# Altium schematic sheet 08-1G Phy2.SchDoc
size B; SheetNumber: 8; SheetTotal: 25; SPICEModelCacheUFVORJTV: <root> / <DocumentId>UFVORJTV</DocumentId> / <CacheFrame Number="0"> / <Model Name="emk105bj105_v-f" Kind="CKT"> / <Text>* EMK105BJ105_V-F     SPICE MODEL  ( General Type ) / *-------------------------------------------------------------------------------------------------------- / * Model Generated by TAIYO YUDEN Corporation (http://www.ty-top.com) / * Version 1.0 / * TAIYO YUDEN Control No. 170508_130520 / * Copyright(c) 2012 TAIYO YUDEN CO.,LTD. All Rights Reserved. / *-------------------------------------------------------------------------------------------------------- / * / * Products Name : Multilayer Ceramic Capacitors / * / * Characteristics : / *     Capacitance : 1 uF , Rated Voltage : 16V , TCC : X5R / *     Case Size : 1.0 x 0.5 / 0.039 x 0.02 [mm/inch] , Thickness : 0.5 / 0.02 [mm/inch] / *     (Conditions: Temperature = 25 degC , DC Bias Current/Voltage = 0A / 0V) / * / * Frequency Range : 40Hz - 3GHz / * / * External Node Assignments : / * / *  1  o---| |---o  2 / * / *-------------------------------------------------------------------------------------------------------- / .SubCkt EMK105BJ105_V-F 1 2 / **************************** / C0 1 110 0.68309u / Cm 1 101 0.26053u / C1 101 102 0.94076u / Rc1 101 102 1.9029k / C2 102 103 0.66707u / Rc2 102 103 120.36 / C3 103 110 0.57203u / Rc3 103 110 2.1097 / C2m 1 301 0.1871u / C21 301 302 3.2494u / Rc21 301 302 1.1117k / C22 302 303 2.1014u / Rc22 302 303 1.484k / C23 303 304 2.1172u / Rc23 303 304 1.3876k / C24 304 305 0.75729u / Rc24 304 305 332.59 / C25 305 306 0.94401u / Rc25 305 306 249.09 / C26 306 307 0.34674u / Rc26 306 307 28.352 / C27 307 308 0.37158u / Rc27 307 308 19.989 / C28 308 309 0.17933u / Rc28 308 309 31.748 / C29 309 110 0.016445u / Rc29 309 110 1.0592 / Rp0 1 110 100Meg / L0 110 120 0.2216n / Lm 120 130 0.1509n / L1 120 121 0.12659n / RL1 121 130 0.85161 / L2 120 122 0.15996n / RL2 122 130 0.42469 / L3 120 123 7.9543n / RL3 123 130 0.54643m / CR 120 124 0.24334u / LR 124 125 0.090738n / RR 125 130 68.076m / CL 130 140 2.7354p / LL 130 140 0.10762n / RL 130 140 50.614 / Rs 140 2 7.5416m / **************************** / .ends EMK105BJ105_V-F</Text> / </Model> / </CacheFrame> / </root>
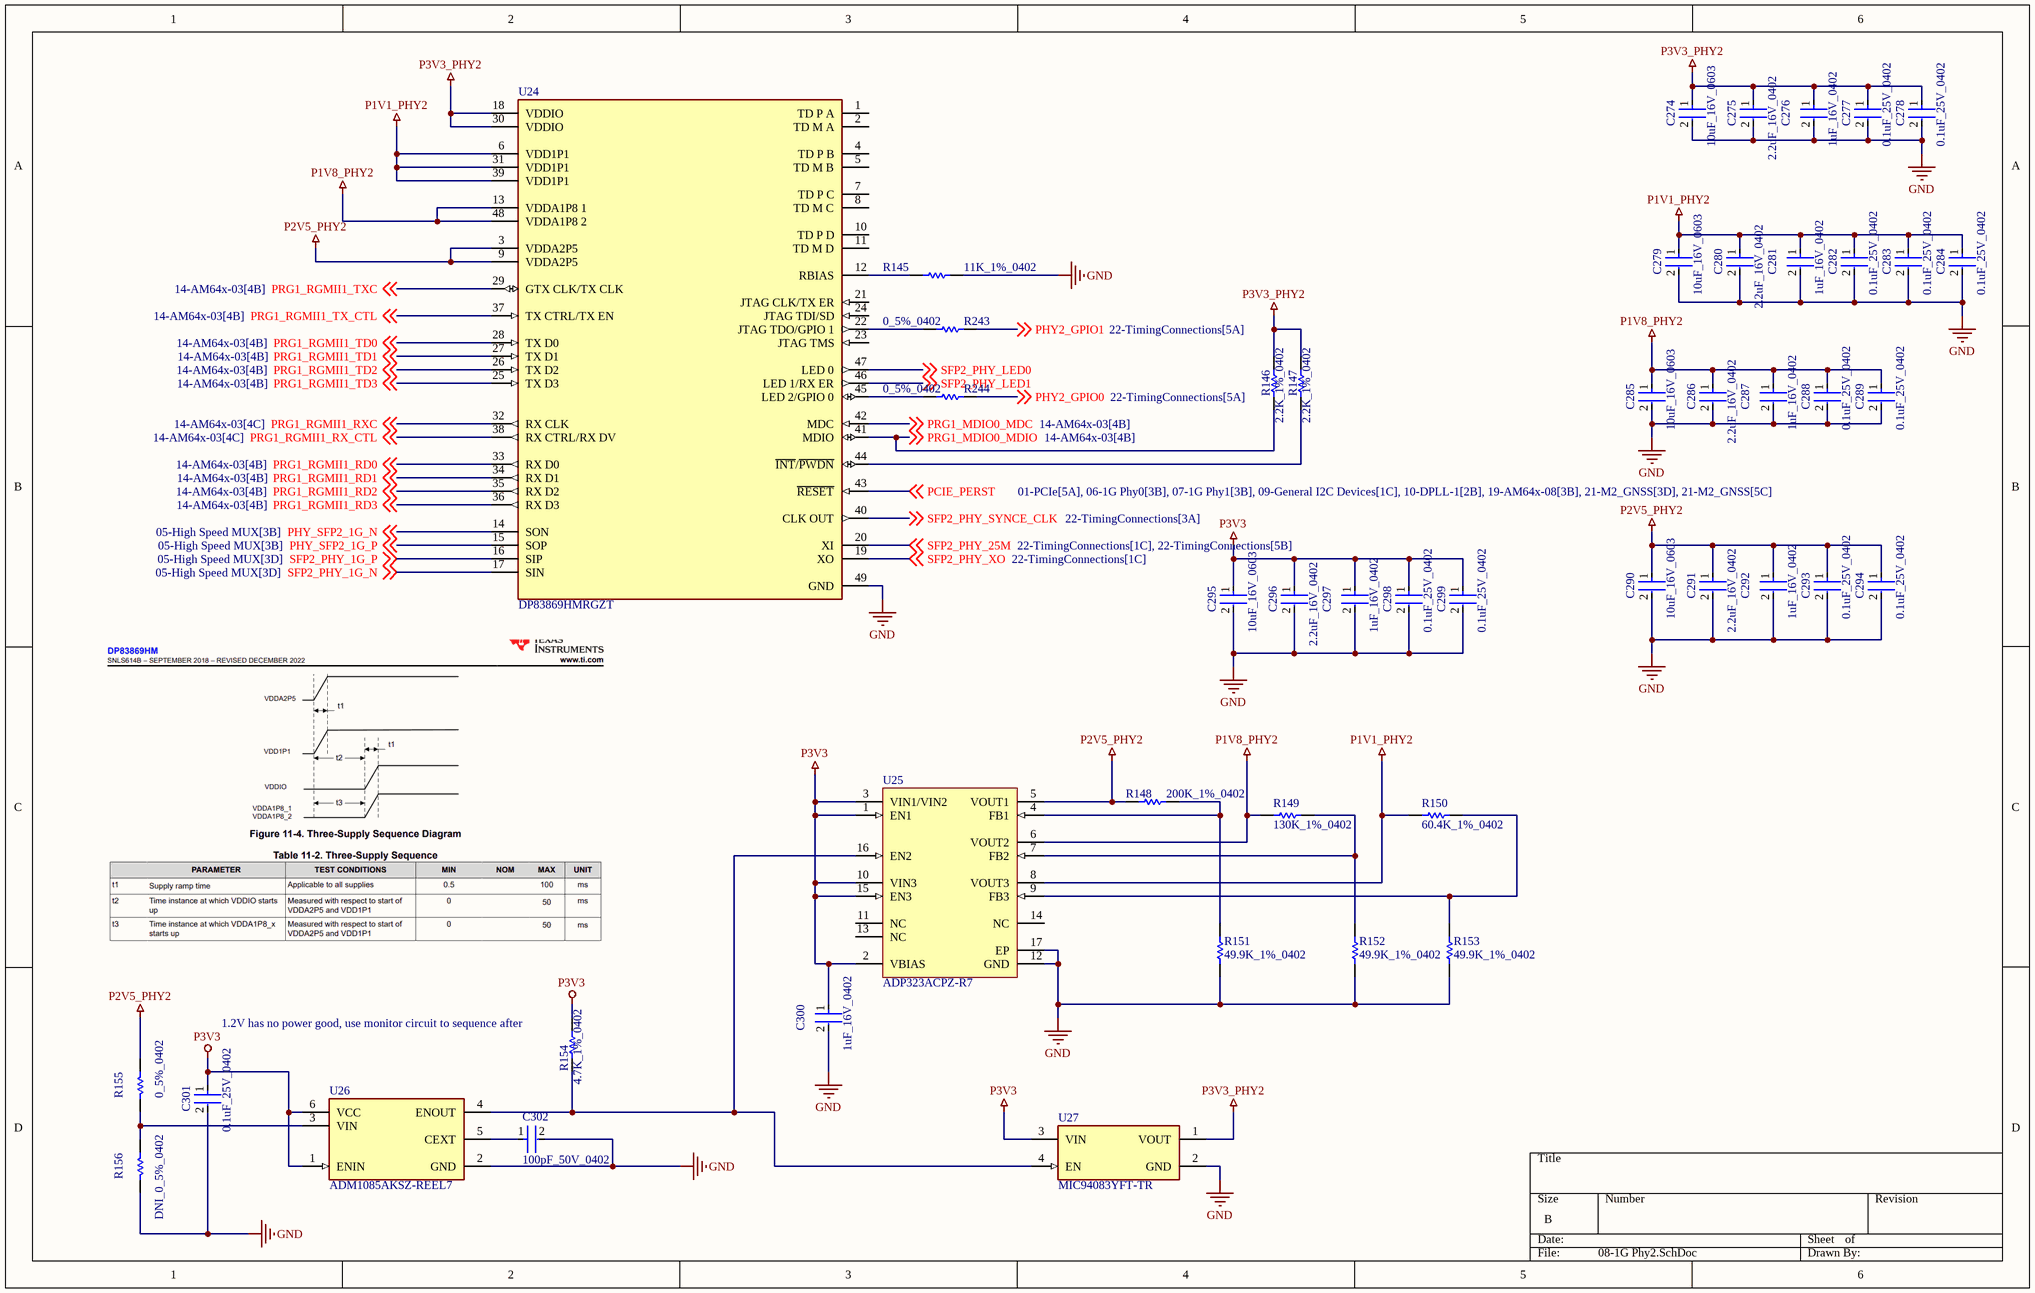
[diagram p0: 08-1G Phy2.SchDoc]

## Parts
C274  10uF_16V_0603  [FP-0603-L_1_6_0_2-W_0_8_0-MFG]
C275  2.2uF_16V_0402  [FP-C1005-050-0_05-IPC_A]
C276  1uF_16V_0402  [FP-0402-L_1_0_0_05-W_0_5-IPC_A]
C277  0.1uF_25V_0402  [FP-0402-L_1_0_1-W_0_5_0_1-IPC_C]
C278  0.1uF_25V_0402  [FP-0402-L_1_0_1-W_0_5_0_1-IPC_C]
C279  10uF_16V_0603  [FP-0603-L_1_6_0_2-W_0_8_0-MFG]
C280  2.2uF_16V_0402  [FP-C1005-050-0_05-IPC_A]
C281  1uF_16V_0402  [FP-0402-L_1_0_0_05-W_0_5-IPC_A]
C282  0.1uF_25V_0402  [FP-0402-L_1_0_1-W_0_5_0_1-IPC_C]
C283  0.1uF_25V_0402  [FP-0402-L_1_0_1-W_0_5_0_1-IPC_C]
C284  0.1uF_25V_0402  [FP-0402-L_1_0_1-W_0_5_0_1-IPC_C]
C285  10uF_16V_0603  [FP-0603-L_1_6_0_2-W_0_8_0-MFG]
C286  2.2uF_16V_0402  [FP-C1005-050-0_05-IPC_A]
C287  1uF_16V_0402  [FP-0402-L_1_0_0_05-W_0_5-IPC_A]
C288  0.1uF_25V_0402  [FP-0402-L_1_0_1-W_0_5_0_1-IPC_C]
C289  0.1uF_25V_0402  [FP-0402-L_1_0_1-W_0_5_0_1-IPC_C]
C290  10uF_16V_0603  [FP-0603-L_1_6_0_2-W_0_8_0-MFG]
C291  2.2uF_16V_0402  [FP-C1005-050-0_05-IPC_A]
C292  1uF_16V_0402  [FP-0402-L_1_0_0_05-W_0_5-IPC_A]
C293  0.1uF_25V_0402  [FP-0402-L_1_0_1-W_0_5_0_1-IPC_C]
C294  0.1uF_25V_0402  [FP-0402-L_1_0_1-W_0_5_0_1-IPC_C]
C295  10uF_16V_0603  [FP-0603-L_1_6_0_2-W_0_8_0-MFG]
C296  2.2uF_16V_0402  [FP-C1005-050-0_05-IPC_A]
C297  1uF_16V_0402  [FP-0402-L_1_0_0_05-W_0_5-IPC_A]
C298  0.1uF_25V_0402  [FP-0402-L_1_0_1-W_0_5_0_1-IPC_C]
C299  0.1uF_25V_0402  [FP-0402-L_1_0_1-W_0_5_0_1-IPC_C]
C300  1uF_16V_0402  [FP-0402-L_1_0_0_05-W_0_5-IPC_A]
C301  0.1uF_25V_0402  [FP-0402-L_1_0_1-W_0_5_0_1-IPC_C]
C302  100pF_50V_0402  [FP-C0402-BB-MFG]
R145  11K_1%_0402  [RESC1005X40X25LL05T10]
R146  2.2K_1%_0402  [RESC1005X40X25ML10T10]
R147  2.2K_1%_0402  [RESC1005X40X25ML10T10]
R148  200K_1%_0402  [RESC1005X40X25LL10T10]
R149  130K_1%_0402  [RESC1005X40X25NL10T10]
R150  60.4K_1%_0402  [RESC1005X40X25LL05T10]
R151  49.9K_1%_0402  [RESC1005X40X25LL10T10]
R152  49.9K_1%_0402  [RESC1005X40X25LL10T10]
R153  49.9K_1%_0402  [RESC1005X40X25LL10T10]
R154  4.7K_1%_0402  [RESC1005X40X25NL10T10]
R155  0_5%_0402  [RESC1005X40X25LL10T10]
R156  DNI_0_5%_0402  [RESC1005X40X25LL10T10]  (no BOM)
R243  0_5%_0402  [RESC1005X40X25LL10T10]
R244  0_5%_0402  [RESC1005X40X25LL10T10]
U24  DP83869HMRGZT  [FP-RGZ0048B-IPC_A]
U25  ADP323ACPZ-R7  [ADI-CP-16-27_N]
U26  ADM1085AKSZ-REEL7  [FP-KS-6-IPC_B]
U27  MIC94083YFT-TR  [FP-FTDFN085085-4LD-PL-1-MFG]

## Nets
GND: C274.2 C275.2 C276.2 C277.2 C278.2 C279.2 C280.2 C281.2 C282.2 C283.2 C284.2 C285.2 C286.2 C287.2 C288.2 C289.2 C290.2 C291.2 C292.2 C293.2 C294.2 C295.2 C296.2 C297.2 C298.2 C299.2 C300.2 C301.2 C302.2 R145.2 R151.1 R152.1 R153.1 R156.2 U24.49(GND) U25.12(GND) U25.17(EP) U26.2(GND) U27.2(GND)
P1V1_PHY2: C279.1 C280.1 C281.1 C282.1 C283.1 C284.1 R150.1 U24.6(VDD1P1) U24.31(VDD1P1) U24.39(VDD1P1) U25.8(VOUT3)
P1V8_PHY2: C285.1 C286.1 C287.1 C288.1 C289.1 R149.1 U24.13(VDDA1P8_1) U24.48(VDDA1P8_2) U25.6(VOUT2)
P2V5_PHY2: C290.1 C291.1 C292.1 C293.1 C294.1 R148.1 R155.1 U24.3(VDDA2P5) U24.9(VDDA2P5) U25.5(VOUT1)
P3V3: C295.1 C296.1 C297.1 C298.1 C299.1 C300.1 C301.1 R154.1 U25.1(EN1) U25.2(VBIAS) U25.3(VIN1/VIN2) U25.10(VIN3) U25.15(EN3) U26.1(ENIN) U26.6(VCC) U27.3(VIN)
P3V3_PHY2: C274.1 C275.1 C276.1 C277.1 C278.1 R146.2 R147.2 U24.18(VDDIO) U24.30(VDDIO) U27.1(VOUT)
PCIE_PERST: U24.43(~{RESET}) ; off-sheet PCIE_PERST
PHY2_GPIO0: R244.2 ; off-sheet PHY2_GPIO0
PHY2_GPIO1: R243.2 ; off-sheet PHY2_GPIO1
PHY_SFP2_1G_N: U24.14(SON) ; off-sheet PHY_SFP2_1G_N
PHY_SFP2_1G_P: U24.15(SOP) ; off-sheet PHY_SFP2_1G_P
PRG1_MDIO0_MDC: U24.42(MDC) ; off-sheet PRG1_MDIO0_MDC
PRG1_MDIO0_MDIO: R146.1 U24.41(MDIO) ; off-sheet PRG1_MDIO0_MDIO
PRG1_RGMII1_RD0: U24.33(RX_D0) ; off-sheet PRG1_RGMII1_RD0
PRG1_RGMII1_RD1: U24.34(RX_D1) ; off-sheet PRG1_RGMII1_RD1
PRG1_RGMII1_RD2: U24.35(RX_D2) ; off-sheet PRG1_RGMII1_RD2
PRG1_RGMII1_RD3: U24.36(RX_D3) ; off-sheet PRG1_RGMII1_RD3
PRG1_RGMII1_RX_CTL: U24.38(RX_CTRL/RX_DV) ; off-sheet PRG1_RGMII1_RX_CTL
PRG1_RGMII1_RXC: U24.32(RX_CLK) ; off-sheet PRG1_RGMII1_RXC
PRG1_RGMII1_TD0: U24.28(TX_D0) ; off-sheet PRG1_RGMII1_TD0
PRG1_RGMII1_TD1: U24.27(TX_D1) ; off-sheet PRG1_RGMII1_TD1
PRG1_RGMII1_TD2: U24.26(TX_D2) ; off-sheet PRG1_RGMII1_TD2
PRG1_RGMII1_TD3: U24.25(TX_D3) ; off-sheet PRG1_RGMII1_TD3
PRG1_RGMII1_TX_CTL: U24.37(TX_CTRL/TX_EN) ; off-sheet PRG1_RGMII1_TX_CTL
PRG1_RGMII1_TXC: U24.29(GTX_CLK/TX_CLK) ; off-sheet PRG1_RGMII1_TXC
SFP2_PHY_1G_N: U24.17(SIN) ; off-sheet SFP2_PHY_1G_N
SFP2_PHY_1G_P: U24.16(SIP) ; off-sheet SFP2_PHY_1G_P
SFP2_PHY_25M: U24.20(XI) ; off-sheet SFP2_PHY_25M
SFP2_PHY_LED0: U24.47(LED_0) ; off-sheet SFP2_PHY_LED0
SFP2_PHY_LED1: U24.46(LED_1/RX_ER) ; off-sheet SFP2_PHY_LED1
SFP2_PHY_SYNCE_CLK: U24.40(CLK_OUT) ; off-sheet SFP2_PHY_SYNCE_CLK
SFP2_PHY_XO: U24.19(XO) ; off-sheet SFP2_PHY_XO
NetC302_1: C302.1 U26.5(CEXT)
NetR145_1: R145.1 U24.12(RBIAS)
NetR147_1: R147.1 U24.44(~{INT}/~{PWDN})
NetR148_2: R148.2 R151.2 U25.4(FB1)
NetR149_2: R149.2 R152.2 U25.7(FB2)
NetR150_2: R150.2 R153.2 U25.9(FB3)
NetR154_2: R154.2 U25.16(EN2) U26.4(ENOUT) U27.4(EN)
NetR155_2: R155.2 R156.1 U26.3(VIN)
NetR243_1: R243.1 U24.22(JTAG_TDO/GPIO_1)
NetR244_1: R244.1 U24.45(LED_2/GPIO_0)

Not connected (* = marked no-connect by the designer): U24 1(TD_P_A) 2(TD_M_A) 4(TD_P_B) 5(TD_M_B) 7(TD_P_C) 8(TD_M_C) 10(TD_P_D) 11(TD_M_D) 21(JTAG_CLK/TX_ER) 23(JTAG_TMS) 24(JTAG_TDI/SD); U25 11(NC) 13(NC) 14(NC)

## Notes on the sheet
- (near R154) 1.2V has no power good, use monitor circuit to sequence after

## Library data of the parts
C274 C279 C285 C290 C295 = CMP-2000-06226-4: Multilayer Ceramic Capacitor 10uF 16V X5R 20% SMD 0603 T/R; Packaging: Tape and Reel; Construction: Flat; Height: 0.8mm; Max Operating Temperature: 85°C; Dielectric: X5R; Case Code (Metric): 1608; Voltage Rating (DC): 16V; Width: 0.031inch; Voltage Rating: 16V; Length: 0.063inch; RoHS Compliant: Yes; Halogen Free: Halogen Free; Case Code (Imperial): 0603; Capacitance: 10uF; Mount: Surface Mount; Thickness: 0.031inch; Tolerance: 20%; Min Operating Temperature: -55°C; Series: M; Termination: SMD/SMT; Case/Package: 0603; Package Quantity: 1
C275 C280 C286 C291 C296 = CMP-2000-05998-2: Multilayer Ceramic Capacitors 2.2μF ±10% 16V X5R SMD 0402; Capacitance: 2.2uF; REACH SVHC: No SVHC; Series: C; Termination: SMD/SMT; Case Code (Imperial): 0402; Depth: 0.5mm; Mount: Surface Mount; Width: 0.02inch; Package Quantity: 1; Dielectric Material: Ceramic; Length: 1mm; Packaging: Tape and Reel; Case Code (Metric): 1005; RoHS Compliant: Yes; Dielectric: X5R; Max Operating Temperature: 85°C; Lead Free: Lead Free; Weight: 2.3E-05oz; Thickness: 0.022inch; Voltage Rating (DC): 16V; Tolerance: 10%; Voltage Rating: 16V; Resistor Type: Ceramic; Height: 0.5mm; Case/Package: 0402; Min Operating Temperature: -55°C
C276 C281 C287 C292 C297 C300 = CMP-14477-000104-2: None; Tolerance: 10%; Voltage Rating: 16V; Dielectric: X5R; Capacitance: 1uF; Packaging: Tape and Reel; Depth: 0.5mm; Mount: Surface Mount; Thickness: 0.022inch; Package Quantity: 1; Min Operating Temperature: -55°C; Series: M; Voltage Rating (DC): 16V; Termination: SMD/SMT; Case/Package: 0402; Number of Pins: 2; Case Code (Imperial): 0402; Length: 1mm; Halogen Free: Halogen Free; Case Code (Metric): 1005; Width: 0.02inch; RoHS Compliant: Yes; Radiation Hardening: No; Max Operating Temperature: 85°C; Height: 0.5mm; Construction: Flat
C277 C278 C282-C284 C288 C289 C293 C294 C298 C299 C301 = CMP-2008-02519-2: General Purpose Ceramic Capacitor, 0402, 100nF, 10%, X7R, 15%, 25V; Package Quantity: 1; Capacitance: 100nF; Min Operating Temperature: -55°C; Voltage: 25V; Voltage Rating: 25V; Construction: Flat; Max Operating Temperature: 125°C; Radiation Hardening: No; Depth: 0.5mm; Thickness: 0.022inch; Voltage Rating (DC): 25V; Number of Pins: 2; Lead Free: Lead Free; Series: -; REACH SVHC: No SVHC; Length: 1mm; Dielectric: X7R; RoHS Compliant: Yes; Mount: Surface Mount; Packaging: Tape and Reel; Case/Package: 0402; Case Code (Imperial): 0402; Termination: SMD/SMT; Width: 0.02inch; Case Code (Metric): 1005; Tolerance: 10%
C302 = CMP-2008-03417-2: CAP CER 100PF 50V C0G/NP0 0402; Manufacturer: Kemet; Manufacturer Part Number: C0402C101G5GACTU; Material: Ceramic; Temperature Characteristic: C0G; Tolerance: 0.02; Temperature Coefficient: 15%; Temperature Range High: +125°C; Lead Free: Yes; Capacitance: 100 pF; Value: 100 pF; ComponentLink2URL: https://content.kemet.com/datasheets/KEM_C1002_X7R_SMD.pdf; Automotive: No; Voltage Rating: 50 V; Category: Cap; Device Class L2: Capacitors; ComponentLink2Description: Datasheet; Mouser Description: Multilayer Ceramic Capacitors MLCC - SMD/SMT 50volts 100pF C0G 2%; RoHS: TRUE; Device Class L3: Ceramic Capacitors; Temperature Range Low: -55°C; Octopart: https://octopart.com/c0402c101g5gactu-kemet-16782744; Height: 0.55mm; Ipc Land Pattern Name: CAPC10050X50; Package: C0402-BB; Device Class L1: Passive Components; Temperature: -55°C to +125°C; Digikey Description: CAP CER 100PF 50V C0G/NP0 0402
R145 = CMP-2002-07365-1: Manufacturer: Yageo / Phycomp; Part Number: RC0402FR-0711KL
R146 R147 = CMP-2002-06097-1: Part Number: MC00625W040212K2; Manufacturer: Multicomp
R148 = CMP-2002-04904-1: Part Number: CR0402-FX-2003GLF; Manufacturer: Bourns
R149 = CMP-2002-05688-1: Part Number: CRG0402F130K; Manufacturer: TE Connectivity / AMP
R150 = CMP-2002-07763-1: Manufacturer: Yageo / Phycomp; Part Number: RC0402FR-0760K4L
R151-R153 = CMP-1011-00702-2: Manufacturer: Bourns; Part Number: CR0402-FX-4992GLF
R154 = CMP-2002-05217-1: Manufacturer: Bourns; Part Number: CR0402-FX-4701GLF
R155 R156 R243 R244 = CMP-2002-04569-1: Manufacturer: KOA Speer; Part Number: RK73Z1ETTP
U24 = CMP-04874-000002-2: IC TRANSCEIVER 1/1 48FN; RoHS Compliant: Yes
U25 = CMP-0786-00062-1: Triple, 200 mA, Low Noise, High PSRR Voltage Regulator, 2.5 to 5.5 V Vin, Adjustable Vout, Industrial, 16-pin QFN (CP-16-27), Reel; Manufacturer: Analog Devices; Vout Adjustable Range: 0.5V to 5V; Iout max: 200mA; Vin (max) (V): 5.5; Supply Current IGND @ Small Load: 85uA; Vin (min) (V): 2.5; ComponentLink2URL: http://www.analog.com/static/imported-files/data_sheets/ADP322_323.pdf; Code_JEDEC: MO-229; Mounting Technology: Surface Mount; DatasheetVersion: Rev. A; PartNumber: ADP323ACPZ-R7; ComponentLink3URL: http://www.analog.com/static/imported-files/packages/PKG_PDF/LFCSP(CP)/CP_16_27.pdf; ComponentLink4Description: URL Link1; PackageVersion: 091609-A, 09/2009; ComponentLink1Description: Manufacturer URL; ComponentLink3Description: Package Specification; Packing: Reel; PackageReference: CP-16-27; ComponentLink4URL: Product URL:http://www.analog.com/en/ADP323/productSearch.html; ComponentLink1URL: http://www.analog.com/en/index.html; PackageDescription: 16-Pin Lead Frame Chip Scale Package, Body 3 x 3 mm, Pitch 0.5 mm; ComponentLink2Description: Datasheet
U26 = CMP-09140-000008-1: IC SUPERVISOR 1 CHANNEL SC70-6; Min Reset Threshold Voltage: 560mV; Operating Supply Voltage: 125V; Operating Supply Current: 10uA; Reset: Active High; Max Reset Threshold Voltage: 640mV; Watchdog Timer: No; Min Supply Voltage: 2.25V; Number of Voltages Monitored: 1; Max Supply Current: 15uA; Threshold Voltage: 600mV; Max Supply Voltage: 3.6V; Nominal Supply Current: 10uA; Mount: Surface Mount; Width: 1.35mm; Max Operating Temperature: 125°C; Lead Free: Contains Lead; Package Quantity: 3000; Undervoltage Threshold: 560mV; Type: Sequencer; Packaging: Tape and Reel; Min Operating Temperature: -40°C; Radiation Hardening: No; REACH SVHC: No SVHC; Overvoltage Threshold: 640mV; Number of Pins: 6; Case/Package: SC; Length: 2.2mm; Height: 1mm; Number of Monitored Inputs: 1
U27 = CMP-06317-000053-1: IC PWR SWITCH P-CHAN 1:1 4TMLF; Turn-On Delay Time: 1.5us; Turn-Off Delay Time: 200ns; On-State Resistance: 67mR; Output Current: 2A; Min Supply Voltage: 1.7V; Number of Outputs: 1; Interface: On/Off; Output Configuration: High Side; Max Supply Voltage: 5.5V; Radiation Hardening: No; Min Operating Temperature: -40°C; Mount: Surface Mount; Series: -; RoHS Compliant: Yes; Number of Pins: 4; Reach SVHC Compliant: Yes; On-state Resistance-Max: 67MR; Package Quantity: 5000; Packaging: Tape and Reel; Max Output Current: 2A; Supply Current: 2A; Lead Free: Lead Free; Current Rating: 2A; Max Operating Temperature: 125°C; Rated Current-Max: 2A; Nominal Supply Current: 2A